# Altium schematic sheet BMA400_ACC_LinkitV3.SchDoc
size A4; Organization: Arribada Initiative; Address1: https://github.com/arribada; Address2: contact@arribada.org; Address3: arribada.org; Address4: UK - Portsmouth; DocumentNumber: 7; SheetNumber: 8; SheetTotal: 14
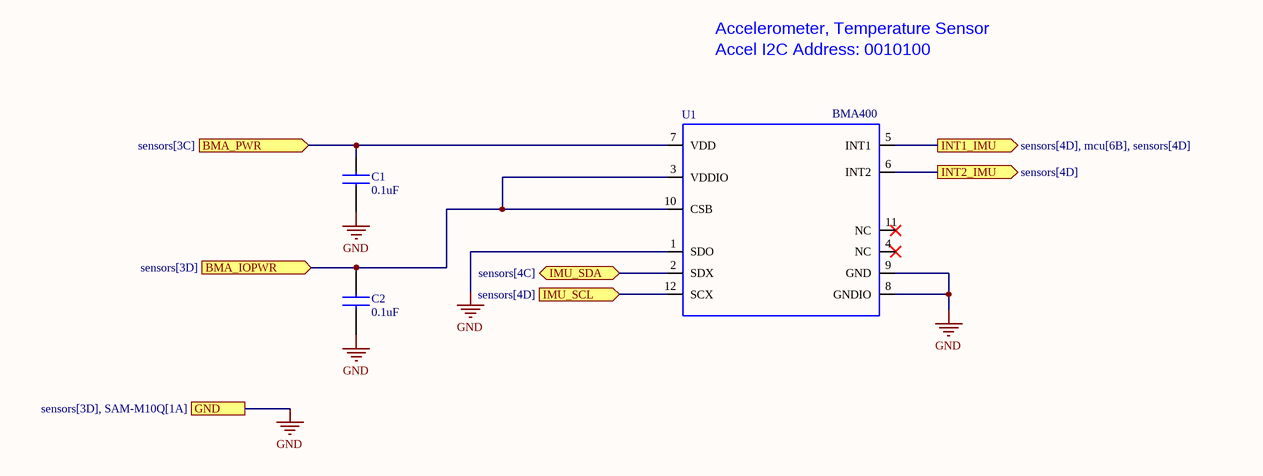
[diagram p0: BMA400_ACC_LinkitV3.SchDoc]

## Parts
C1  value 0.1uF  [CAPC0603X33N]  (hidden comment: 100nF)
C2  value 0.1uF  [CAPC0603X33N]  (hidden comment: 100nF)
U1  BMA400  [LGA12-BMA400]

## Ports
BMA_IOPWR (in, see sensors[3D]), BMA_PWR (in, see sensors[3C]), GND (see sensors[3D], SAM-M10Q[1A]), IMU_SCL (in, see sensors[4D]), IMU_SDA (bidir, see sensors[4C]), INT1_IMU (out, see sensors[4D], mcu[6B], sensors[4D]), INT2_IMU (out, see sensors[4D])

## Nets
GND: C1.1 C2.1 U1.1(SDO) U1.8(GNDIO) U1.9(GND) ; port GND
BMA_IOPWR: C2.2 U1.3(VDDIO) U1.10(CSB) ; port BMA_IOPWR
BMA_PWR: C1.2 U1.7(VDD) ; port BMA_PWR
IMU_SCL: U1.12(SCX) ; port IMU_SCL
IMU_SDA: U1.2(SDX) ; port IMU_SDA
INT1_IMU: U1.5(INT1) ; port INT1_IMU
INT2_IMU: U1.6(INT2) ; port INT2_IMU

Not connected (* = marked no-connect by the designer): U1 4(NC)* 11(NC)*

## Notes on the sheet
- Accelerometer, Temperature Sensor
- Accel I2C Address: 0010100
- Title
- Size:
- Date:
- A4
- Reference:
- Time:
- Revision:
- Sheet
- of
- File:

## Library data of the parts
C1 C2 = GRM033Z71C104KE14D: Multilayer Ceramic Capacitors MLCC - SMD/SMT .1UF     16V   10%        0201; Manufacturer_Name: Murata Electronics; Manufacturer 1: Murata; Geometry.Height: 0.33mm; Description 1: Cap Ceramic 0.1uF 16V X7R 10% Pad SMD 0201 125C T/R; Mouser Part Number: 81-GRM033Z71C104KE4D; Mouser Price/Stock: https://www.mouser.co.uk/ProductDetail/Murata-Electronics/GRM033Z71C104KE14D?qs=lEfY3O89AqkdMqrSfAAk2w%3D%3D; Manufacturer_Part_Number: GRM033Z71C104KE14D; Datasheet Link: http://www.murata.com/~/media/webrenewal/support/library/catalog/products/capacitor/mlcc/c02e.pdf; Supplier 1: Mouser; Supplier Part Number 1: 81-GRM033Z71C104KE4D; Manufacturer Part Number 1: GRM033Z71C104KE14D; RoHS 1: Yes; Category 1: Ceramic Capacitors; Stock 1: 739403; Pricing 1: 1=0,1, 10=0,017, 50=0,017, 100=0,01, 1000=0,008, 10000=0,006 (USD); Case/Package: 0201; RoHS Compliant: Yes
U1 = BMA400: IC AXL Accel/temp SPI/I2C 12LGA; Manufacturer: Bosch Sensortec; Manufacturers Part Number: BMA400; Temp Min: -40; Temp Max: 85; Supplier 1: Digi-Key; Supplier Part Number 1: 828-1081-1-ND; Supplier 2: Mouser; Supplier Part Number 2: 262-BMA400